# EAGLE design RC (EAGLE 9.6.2)
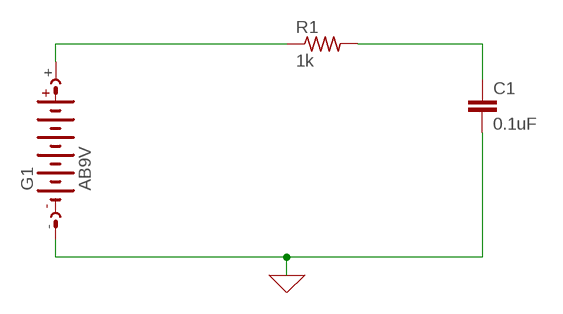
[diagram p0: schematic, sheet 1]

## Parts
C1  0.1uF  0.1UF-0402-6.3V-10%-X7R  [0402]
G1  AB9V  [AB9V]
R1  1k  R-US_0204/2V  [0204V]

## Nets
0: C1.2 G1.- ; supply symbol labelled GND
N$1: G1.+ R1.1
N$2: C1.1 R1.2

## Library data of the parts
C1 = SparkFun-Capacitors:0.1UF: 0.1µF ceramic capacitors A capacitor is a passive two-terminal electrical component used to store electrical energy temporarily in an electric field.; PROD_ID: CAP-14993
G1 = battery:AB9V: 9-V BATTERY CLIP
R1 = adafruit:R-US_: RESISTOR, American symbol

## Board
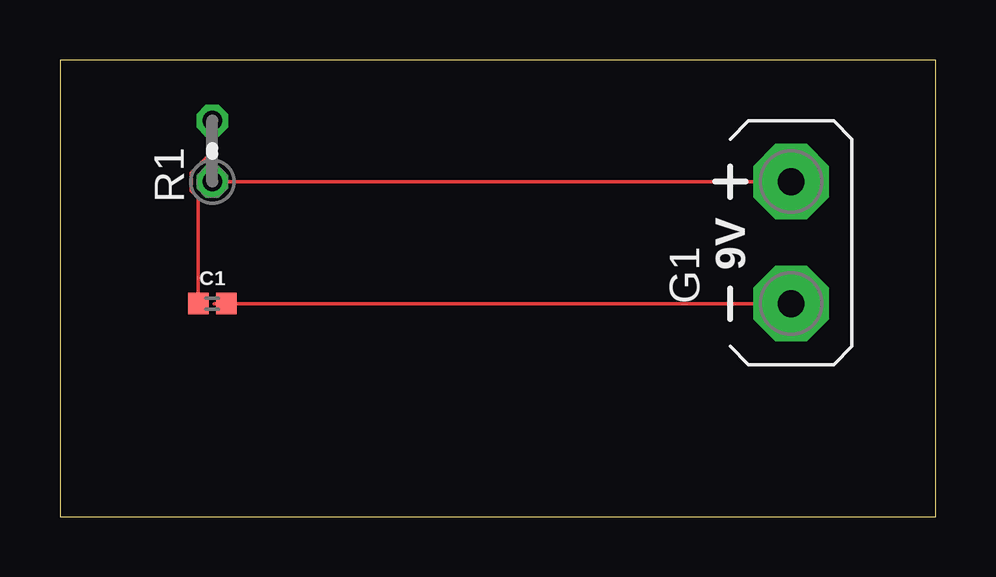
[diagram p1: board, top side]

Size 36.5 x 19.04 mm. Coordinates in mm from the lower left corner, seen from the top.
Outline: 0,0 36.5,0 36.5,19.04 0,19.04 0,0
Copper layers (1*16): Top 0.035mm / dielectric 1.5mm / Bottom 0.035mm
Design rules "default": minimum track width 6mil, minimum drill 0.35mm, track to track 6mil, track to pad 6mil, pad to pad 6mil, via to via 6mil, smd to smd 6mil, copper to edge 40mil, drill to drill 6mil, minimum pad ring 10mil, minimum via ring 8mil, stop-mask expansion 4mil, vias tented up to drill 0mil, thermal gap 10mil

### Footprints (pad centres in the part's own frame; a part is rotated, then mirrored left to right if it is on the bottom)
0402 = smd 0.85 x 0.9: 1 -0.58,0; 2 0.58,0
AB9V = drill 1.118 pad 3.15 octagon: + 0,2.54; - 0,-2.54
0204V = drill 0.813 octagon: 1 -1.27,0; 2 1.27,0

### Placement (x,y rotation side)
C1  6.35,8.89 0 top
G1  30.48,11.43 0 top
R1  6.35,15.24 90 top

### Tracks (layer width: path | path; a pad name or v marks a point on that pad's centre or on a via)
0
  Top 0.152: G1.- C1.2 6.42,8.89
N$1
  Top 0.152: G1.+ R1.1
N$2
  Top 0.152: R1.2 6.35,15.23 5.46,14.34 5.46,13.6 5.77,13.29 C1.1